# EAGLE design Pi-Bus_Breakout_IO (EAGLE 9.6.2)
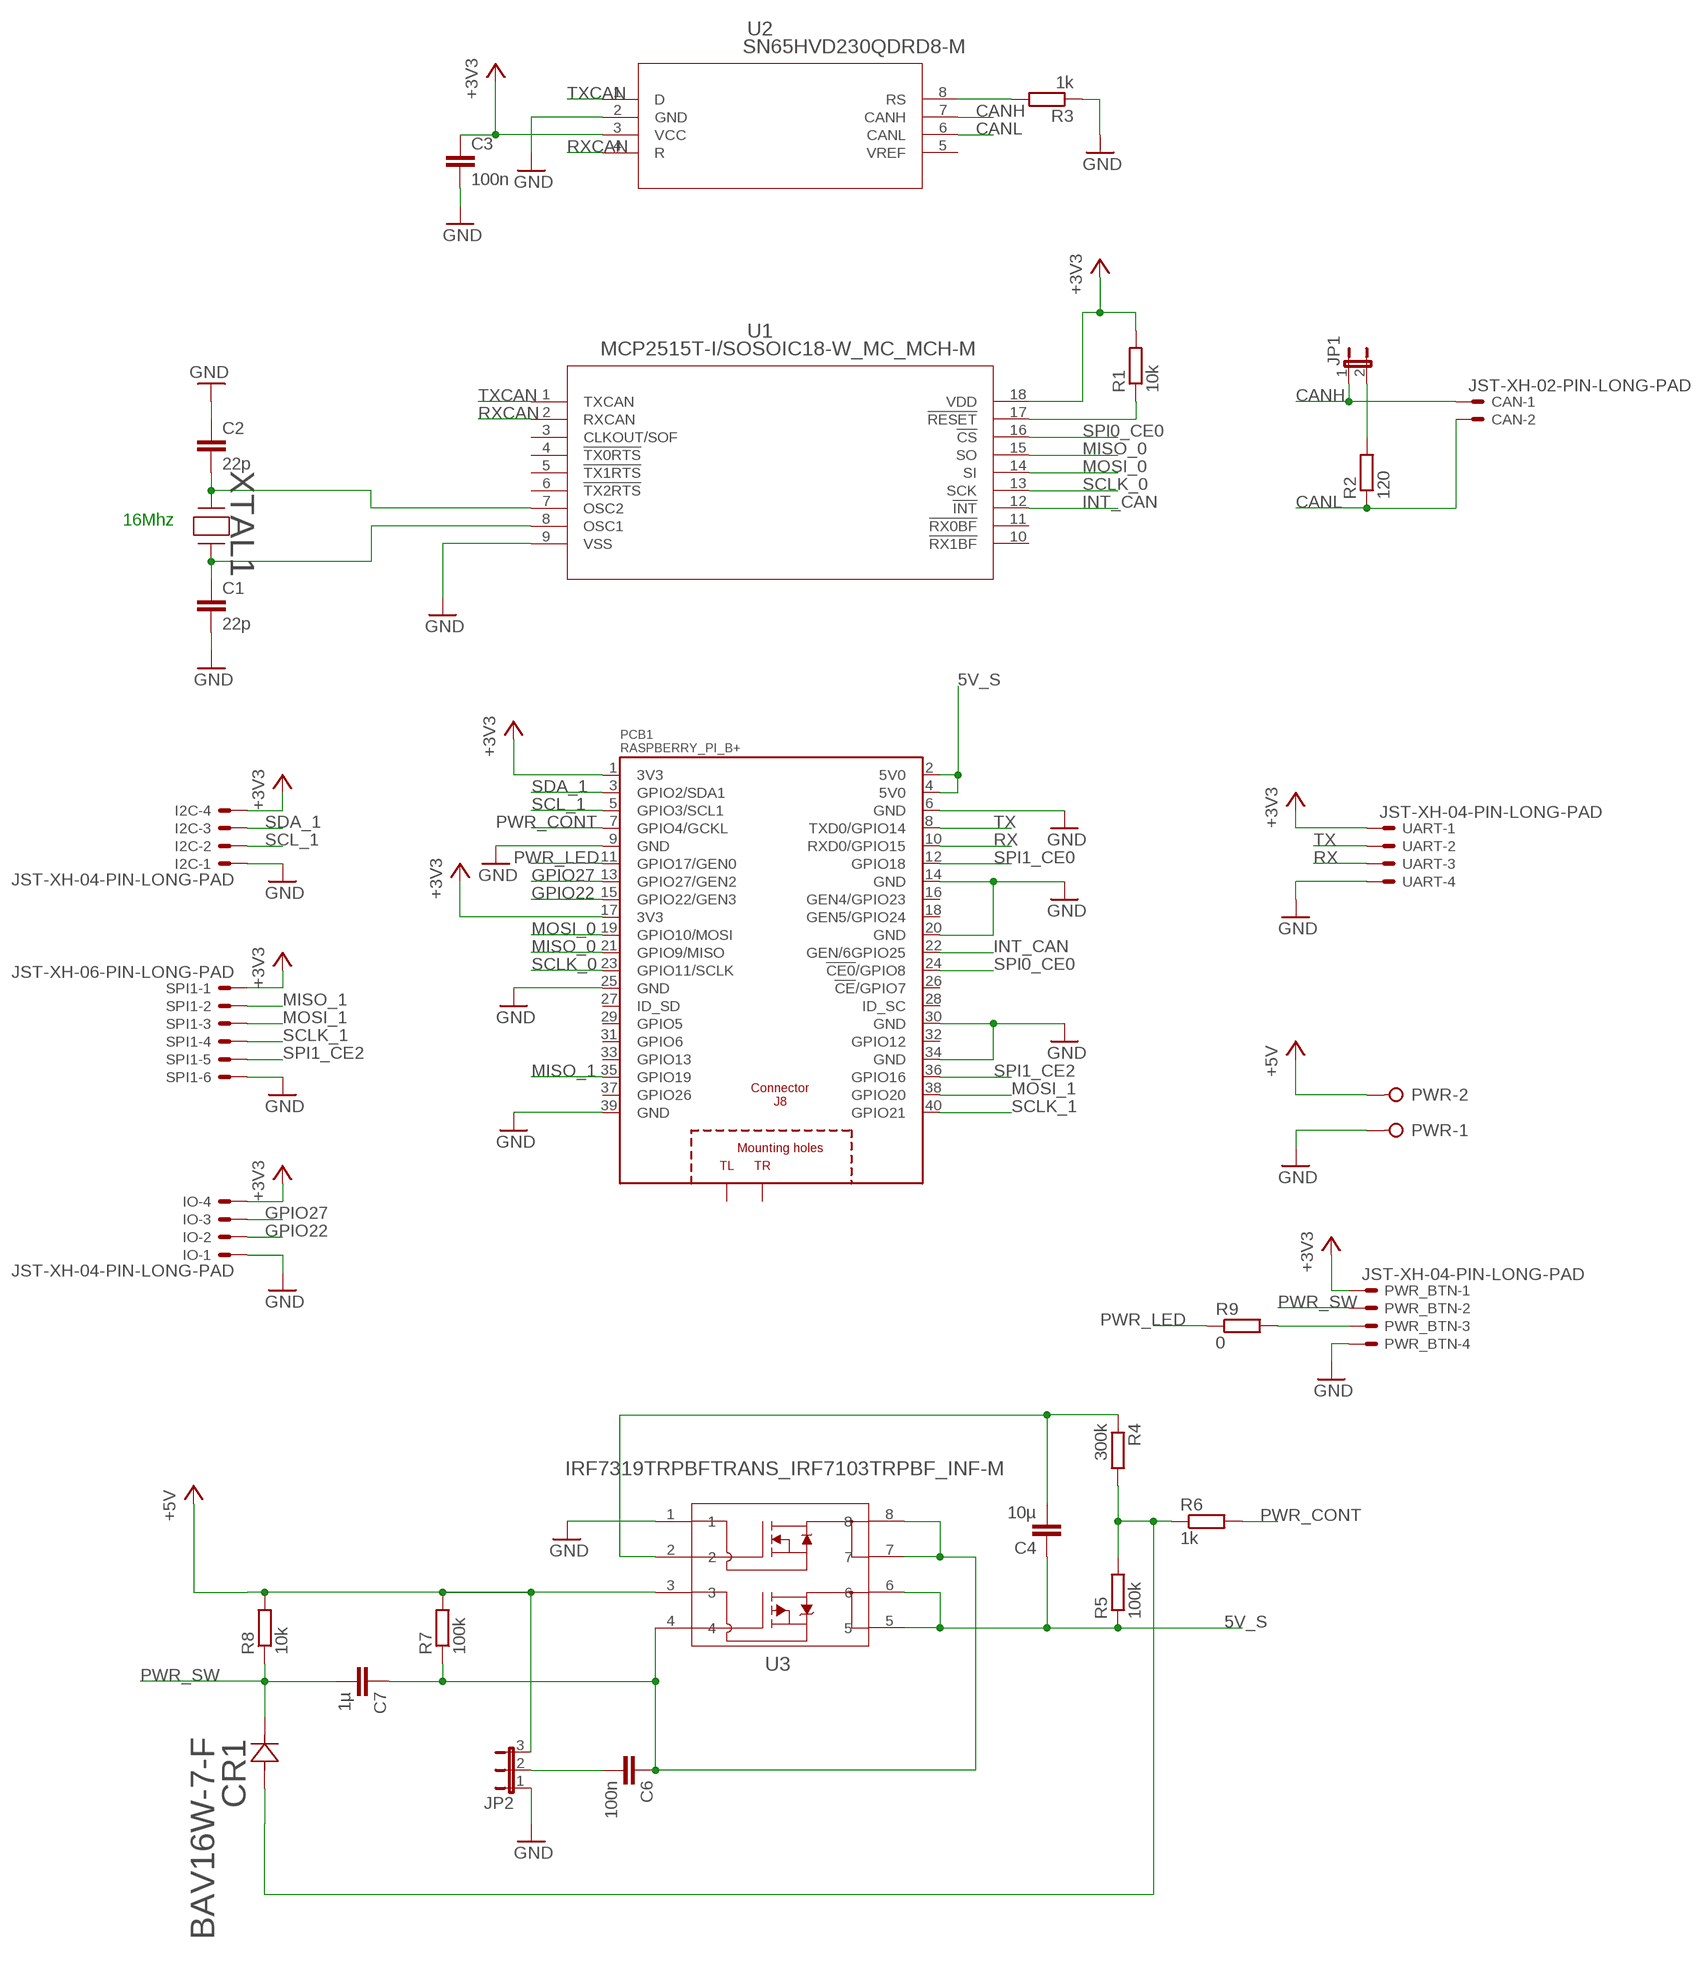
[diagram p0: schematic, sheet 1]

## Parts
C1  22p  C-EUC0805  [C0805]
C2  22p  C-EUC0805  [C0805]
C3  100n  C-EUC0805  [C0805]
C4  10µ  C-EUC0805  [C0805]
C6  100n  C-EUC0805  [C0805]
C7  1µ  C-EUC0805  [C0805]
CAN  JST-XH-02-PIN-LONG-PAD  [JST-XH-02-PACKAGE-LONG-PAD]
CR1  BAV16W-7-F  [SOD123_DIO]
I2C  JST-XH-04-PIN-LONG-PAD  [JST-XH-04-PACKAGE-LONG-PAD]
IO  JST-XH-04-PIN-LONG-PAD  [JST-XH-04-PACKAGE-LONG-PAD]
JP1  JP1E  [JP1]
JP2  JP2E  [JP2]
PCB1  RASPBERRY_PI_B+  [RASPBERRY_PI_B+]
PWR  W237-02P  [W237-132]
PWR_BTN  JST-XH-04-PIN-LONG-PAD  [JST-XH-04-PACKAGE-LONG-PAD]
R1  10k  R-EU_R0805  [R0805]
R2  120  R-EU_R0805  [R0805]
R3  1k  R-EU_R0805  [R0805]
R4  300k  R-EU_R0805  [R0805]
R5  100k  R-EU_R0805  [R0805]
R6  1k  R-EU_R0805  [R0805]
R7  100k  R-EU_R0805  [R0805]
R8  10k  R-EU_R0805  [R0805]
R9  0  R-EU_R0805  [R0805]
SPI1  JST-XH-06-PIN-LONG-PAD  [JST-XH-06-PACKAGE-LONG-PAD]
U1  MCP2515T-I/SOSOIC18-W_MC_MCH-M  [SOIC18-W_MC_MCH-M]
U2  SN65HVD230QDRD8-M  [D8-M]
U3  IRF7319TRPBFTRANS_IRF7103TRPBF_INF-M  [TRANS_IRF7103TRPBF_INF-M]
UART  JST-XH-04-PIN-LONG-PAD  [JST-XH-04-PACKAGE-LONG-PAD]
XTAL1  8Mhz  16.000MHZ_49USMX/30/50/40/18PF  [XTAL_8PF/ATF_EUR]

## Nets
5V_S: C4.1 PCB1.2(5V0) PCB1.4(5V0) R5.1 U3.5 U3.6
+3V3: C3.1 I2C.4 IO.4 PCB1.1(3V3) PCB1.17(3V3) PWR_BTN.1 R1.2 SPI1.1 U1.18(VDD) U2.3(VCC) UART.1
+5V: JP2.3 PWR.2 R7.2 R8.2 U3.3
CANH: CAN.1 JP1.1 U2.7(CANH)
CANL: CAN.2 R2.1 U2.6(CANL)
GND: C1.2 C2.1 C3.2 I2C.1 IO.1 JP2.1 PCB1.6(GND) PCB1.9(GND) PCB1.14(GND) PCB1.20(GND) PCB1.25(GND) PCB1.30(GND) PCB1.34(GND) PCB1.39(GND) PWR.1 PWR_BTN.4 R3.1 SPI1.6 U1.9(VSS) U2.2(GND) U3.1 UART.4
GPIO22: IO.2 PCB1.15(GPIO22/GEN3)
GPIO27: IO.3 PCB1.13(GPIO27/GEN2)
INT_CAN: PCB1.22(GEN/6GPIO25) U1.12(!INT)
MISO_0: PCB1.21(GPIO9/MISO) U1.15(SO)
MISO_1: PCB1.35(GPIO19) SPI1.2
MOSI_0: PCB1.19(GPIO10/MOSI) U1.14(SI)
MOSI_1: PCB1.38(GPIO20) SPI1.3
N$1: R1.1 U1.17(!RESET)
N$2: C1.1 U1.8(OSC1) XTAL1.2
N$3: C2.2 U1.7(OSC2) XTAL1.1
N$4: R3.2 U2.8(RS)
N$5: JP1.2 R2.2
N$6: CR1.2 R4.2 R5.2 R6.1
N$7: PWR_BTN.3 R9.2
N$8: C4.2 R4.1 U3.2
N$9: C6.2 JP2.2
N$12: C6.1 C7.1 R7.1 U3.4 U3.7 U3.8
PWR_CONT: PCB1.7(GPIO4/GCKL) R6.2
PWR_LED: PCB1.11(GPIO17/GEN0) R9.1
PWR_SW: C7.2 CR1.1 PWR_BTN.2 R8.1
RX: PCB1.10(RXD0/GPIO15) UART.3
RXCAN: U1.2(RXCAN) U2.4(R)
SCL_1: I2C.2 PCB1.5(GPIO3/SCL1)
SCLK_0: PCB1.23(GPIO11/SCLK) U1.13(SCK)
SCLK_1: PCB1.40(GPIO21) SPI1.4
SDA_1: I2C.3 PCB1.3(GPIO2/SDA1)
SPI0_CE0: PCB1.24(!CE0!/GPIO8) U1.16(!CS)
SPI1_CE0: PCB1.12(GPIO18)
SPI1_CE2: PCB1.36(GPIO16) SPI1.5
TX: PCB1.8(TXD0/GPIO14) UART.2
TXCAN: U1.1(TXCAN) U2.1(D)
Unconnected: PCB1.16(GEN4/GPIO23) PCB1.18(GEN5/GPIO24) PCB1.26(!CE!/GPIO7) PCB1.27(ID_SD) PCB1.28(ID_SC) PCB1.29(GPIO5) PCB1.31(GPIO6) PCB1.32(GPIO12) PCB1.33(GPIO13) PCB1.37(GPIO26) PCB1.PE_TL(TL) PCB1.PE_TR(TR) U1.3(CLKOUT/SOF) U1.4(!TX0RTS) U1.5(!TX1RTS) U1.6(!TX2RTS) U1.10(!RX1BF) U1.11(!RX0BF)

## Notes on the sheet
- 16Mhz

## Power pins joined to a net without a drawn wire
VREF: U2.5(VREF)

## Library data of the parts
C1-C4 C6 C7 = rcl:C-EU: CAPACITOR, European symbol; SPICEPREFIX: C
CAN = Rembrandt Electronics - JST XH Connectors v1-0:JST-XH-02-PIN: JST XH Connector 2 Pin Wire to board connector. Pitch: 2,54 mm, (0.100") Number of pins: 2 Created by Rembrandt Electronics www.rembrandtelectronics.com
CR1 = BAV16W-7-F:BAV16W-7-F; COPYRIGHT: Copyright (C) 2022 Ultra Librarian. All rights reserved.; MANUFACTURER_PART_NUMBER: BAV16W-7-F; MFR_NAME: Diodes Inc
I2C IO PWR_BTN UART = Rembrandt Electronics - JST XH Connectors v1-0:JST-XH-04-PIN: JST XH Connector 2 Pin Wire to board connector. Pitch: 2,54 mm, (0.100") Number of pins: 4 Created by Rembrandt Electronics www.rembrandtelectronics.com
JP1 = jumper:JP1E: JUMPER
JP2 = jumper:JP2E: JUMPER
PCB1 = my_RASPBERRY_PI_Bplus:RASPBERRY_PI_B+: Raspberry Pi B+ Based on issue: Thursday, July 10, 2014 - Rev 1.2 LBR by Tim R. 07-2014
PWR = con-wago-508:W237-02P: WAGO SREW CLAMP; OC_FARNELL: unknown; OC_NEWARK: unknown
R1-R9 = rcl:R-EU_: RESISTOR, European symbol; SPICEPREFIX: R
SPI1 = Rembrandt Electronics - JST XH Connectors v1-0:JST-XH-06-PIN: JST XH Connector 2 Pin Wire to board connector. Pitch: 2,54 mm, (0.100") Number of pins: 6 Created by Rembrandt Electronics www.rembrandtelectronics.com
U1 = MCP2515T-I_SO:MCP2515T-I/SO; COPYRIGHT: Copyright (C) 2022 Ultra Librarian. All rights reserved.; MANUFACTURER_PART_NUMBER: MCP2515T-I/SO; MFR_NAME: Microchip
U2 = SN65HVD230D:SN65HVD230QDR; COPYRIGHT: Copyright (C) 2022 Ultra Librarian. All rights reserved.; MANUFACTURER_PART_NUMBER: SN65HVD230QDR; MFR_NAME: Texas Instruments
U3 = IRF7319TRPBF:IRF7319TRPBF; COPYRIGHT: Copyright (C) 2022 Ultra Librarian. All rights reserved.; MANUFACTURER_PART_NUMBER: IRF7319TRPBF; MFR_NAME: Infineon
XTAL1 = 16Mhz 49USMX_30_50_40_18PF_ATF:16.000MHZ_49USMX/30/50/40/18PF; COPYRIGHT: Copyright (C) 2022 Ultra Librarian. All rights reserved.; MANUFACTURER_PART_NUMBER: 16.000MHZ 49USMX/30/50/40/18PF/ATF; MFR_NAME: Euroquartz

## Board
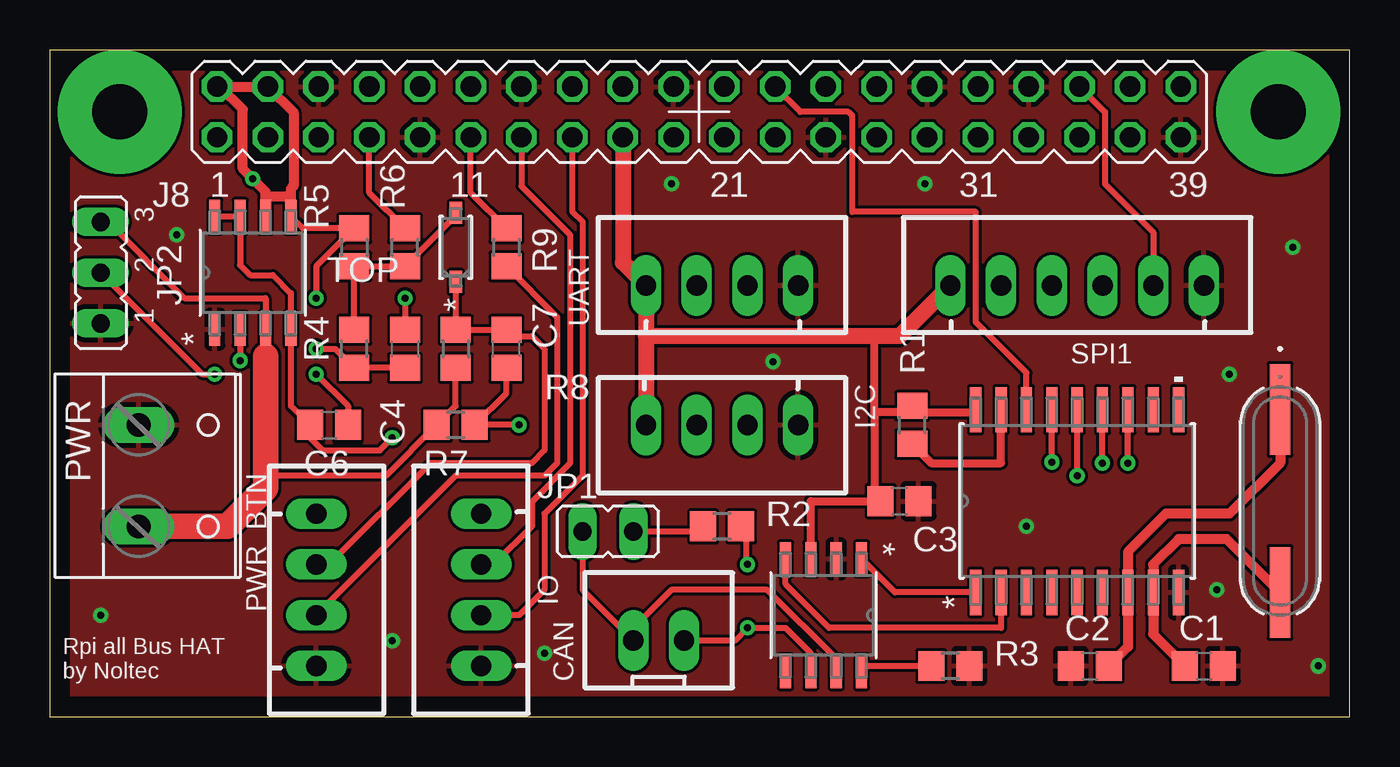
[diagram p1: board, top side]
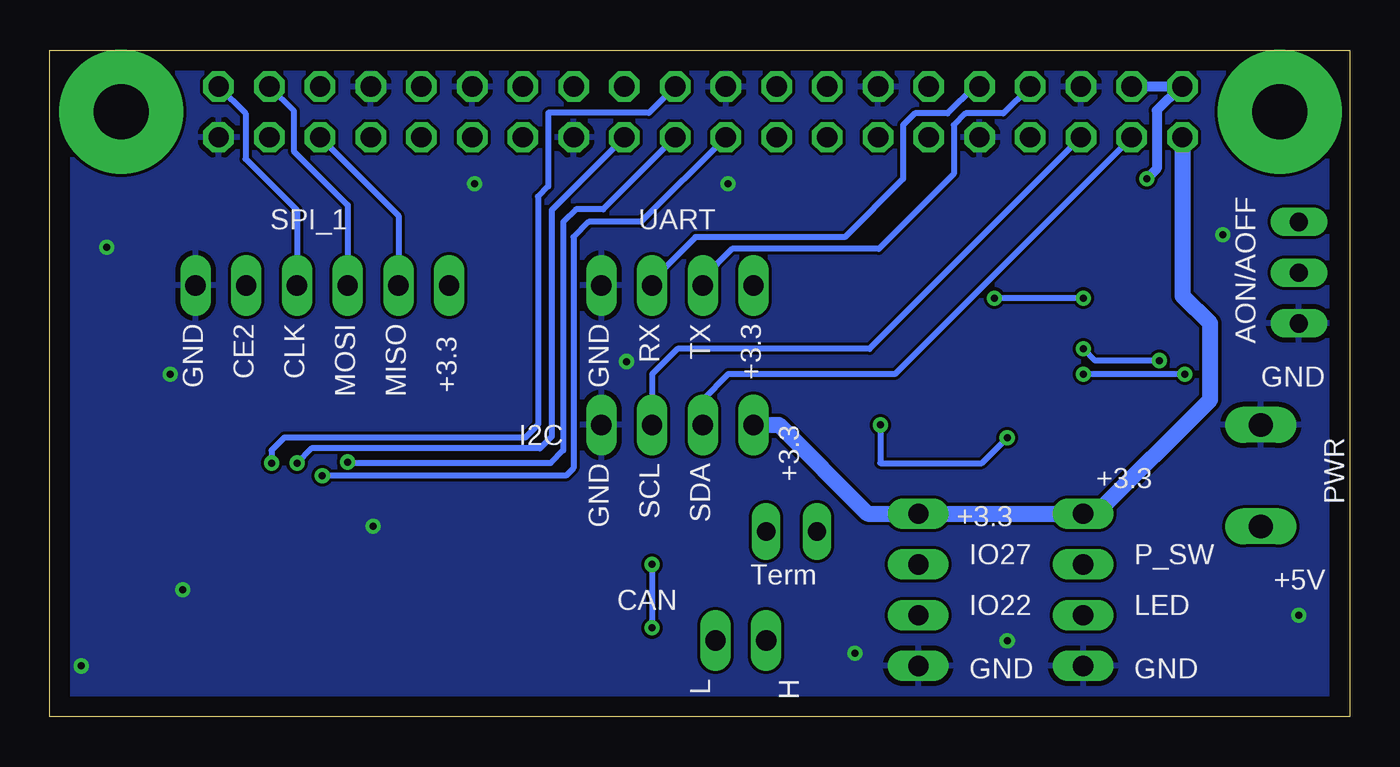
[diagram p2: board, bottom side, seen from below]

Size 65.08 x 33.37 mm. Coordinates in mm from the lower left corner, seen from the top.
Outline: 0,0 65.08,0 65.08,33.37 0,33.37 0,0
Copper layers (1*16): Top 0.035mm / dielectric 0.15mm / Bottom 0.035mm
Design rules "default *": minimum track width 6mil, minimum drill 0.35mm, track to track 6mil, track to pad 6mil, pad to pad 6mil, via to via 6mil, smd to smd 6mil, copper to edge 40mil, drill to drill 6mil, minimum pad ring 10mil, minimum via ring 8mil, stop-mask expansion 4mil, vias tented up to drill 14mil, thermal gap 10mil

### Footprints (pad centres in the part's own frame; a part is rotated, then mirrored left to right if it is on the bottom)
C0805 = smd 1.3 x 1.5: 1 -0.95,0; 2 0.95,0
JST-XH-02-PACKAGE-LONG-PAD = drill 1.016 long: 1 -1.27,0; 2 1.27,0
SOD123_DIO = smd 1.1 x 0.61: 1 -1.725,0; 2 1.725,0
JST-XH-04-PACKAGE-LONG-PAD = drill 1.016 long: 1 -3.81,0; 2 -1.27,0; 3 1.27,0; 4 3.81,0
JP1 = drill 0.914 long: 1 0,-1.27; 2 0,1.27
JP2 = drill 0.914 long: 1 -2.54,0; 2 0,0; 3 2.54,0
RASPBERRY_PI_B+ = drill 1.016 octagon: 1 12.18,-0.84; 2 12.18,1.7; 3 14.72,-0.84; 4 14.72,1.7; 5 17.26,-0.84; 6 17.26,1.7; 7 19.8,-0.84; 8 19.8,1.7; 9 22.34,-0.84; 10 22.34,1.7; 11 24.88,-0.84; 12 24.88,1.7; 13 27.42,-0.84; 14 27.42,1.7; 15 29.96,-0.84; 16 29.96,1.7; 17 32.5,-0.84; 18 32.5,1.7; 19 35.04,-0.84; 20 35.04,1.7; 21 37.58,-0.84; 22 37.58,1.7; 23 40.12,-0.84; 24 40.12,1.7; 25 42.66,-0.84; 26 42.66,1.7; 27 45.2,-0.84; 28 45.2,1.7; 29 47.74,-0.84; 30 47.74,1.7; 31 50.28,-0.84; 32 50.28,1.7; 33 52.82,-0.84; 34 52.82,1.7; 35 55.36,-0.84; 36 55.36,1.7; 37 57.9,-0.84; 38 57.9,1.7; 39 60.44,-0.84; 40 60.44,1.7 | drill 2.75 pad 6.2: PE_TL 7.31,0.43; PE_TR 65.31,0.43
W237-132 = drill 1.194 long: 1 -2.54,-0.635; 2 2.54,-0.635
R0805 = smd 1.3 x 1.5: 1 -0.95,0; 2 0.95,0
JST-XH-06-PACKAGE-LONG-PAD = drill 1.016 long: 1 -6.35,0; 2 -3.81,0; 3 -1.27,0; 4 1.27,0; 5 3.81,0; 6 6.35,0
SOIC18-W_MC_MCH-M = smd 2.27 x 0.558: 1 -4.571,5.08; 2 -4.571,3.81; 3 -4.571,2.54; 4 -4.571,1.27; 5 -4.571,0; 6 -4.571,-1.27; 7 -4.571,-2.54; 8 -4.571,-3.81; 9 -4.571,-5.08; 10 4.571,-5.08; 11 4.571,-3.81; 12 4.571,-2.54; 13 4.571,-1.27; 14 4.571,0; 15 4.571,1.27; 16 4.571,2.54; 17 4.571,3.81; 18 4.571,5.08
D8-M = smd 1.655 x 0.558: 1 -2.821,1.905; 2 -2.821,0.635; 3 -2.821,-0.635; 4 -2.821,-1.905; 5 2.821,-1.905; 6 2.821,-0.635; 7 2.821,0.635; 8 2.821,1.905
TRANS_IRF7103TRPBF_INF-M = smd 1.655 x 0.558: 1 -2.821,1.905; 2 -2.821,0.635; 3 -2.821,-0.635; 4 -2.821,-1.905; 5 2.821,-1.905; 6 2.821,-0.635; 7 2.821,0.635; 8 2.821,1.905
XTAL_8PF/ATF_EUR = smd 4.54 x 1.035: 1 -4.58,0; 2 4.58,0

### Placement (x,y rotation side)
C1  57.78,2.54 0 top
C2  52.07,2.54 0 top
C3  42.54,10.79 0 top
C4  17.78,18.41 270 top
C6  13.97,14.61 0 top
C7  22.86,18.41 90 top
CAN  30.48,3.81 0 top
CR1  20.32,23.5 90 top
I2C  33.65,14.61 180 top
IO  21.59,6.35 90 top
JP1  27.94,9.27 270 top
JP2  2.54,22.23 90 top
PCB1  -3.81,29.84 0 top
PWR  5.08,12.06 270 top
PWR_BTN  13.34,6.35 270 top
R1  43.18,14.61 90 top
R2  33.65,9.53 180 top
R3  45.08,2.54 180 top
R4  15.24,18.41 90 top
R5  15.24,23.5 270 top
R6  17.78,23.5 90 top
R7  20.32,14.61 180 top
R8  20.32,18.41 270 top
R9  22.86,23.5 270 top
SPI1  51.43,21.59 0 top
U1  51.43,10.79 90 top
U2  38.73,5.08 270 top
U3  10.16,22.23 90 top
UART  33.65,21.59 0 top
XTAL1  61.59,10.79 270 top

### Tracks (layer width: path | path; a pad name or v marks a point on that pad's centre or on a via)
5V_S  (via drill 0.35)
  Top 0.305: U3.5 12.67,24.45 R5.1 13.34,22.54 v13.34,20.95 | v17.78,20.95 C4.1
  Top 0.508: PCB1.2 8.51,31.55 | 8.51,31.55 PCB1.4 12.19,30.26 12.19,26.54 12.07,26.42 12.07,26.04 | 12.07,26.04 U3.5 | U3.6 10.79,26.04 | 10.79,26.04 10.79,26.29 v10.16,26.92 9.65,27.43 9.65,30.4 8.51,31.55 | 12.07,26.04 10.79,26.04
  Bottom 0.305: v13.34,20.95 v17.78,20.95
  Bottom 0.508: PCB1.4 PCB1.2 8.46,31.55 9.65,30.35 9.65,27.43 v10.16,26.92
+3V3
  Top 0.406: U1.18 46.35,15.24 43.49,15.24 R1.2 42.86,15.24 41.27,15.24 | U2.3 38.1,10.79 C3.1 41.27,11.12 41.27,15.24 | 41.27,15.24 41.27,19.05
  Top 0.813: 29.84,19.05 UART.1 28.69,22.75 PCB1.17 | 29.84,19.05 I2C.4 | SPI1.1 42.54,19.05 41.27,19.05 29.84,19.05
  Bottom 0.813: I2C.4 28.57,14.61 24.13,10.16 IO.4 PWR_BTN.1 12.7,10.16 6.99,15.88 6.99,19.68 8.37,21.07 PCB1.1
+5V
  Top 0.305: R8.2 20.32,15.55 R7.2 16.83,12.06 10.79,12.06 | JP2.3 2.92,24.77 6.73,20.95 10.79,20.95 U3.3
  Top 0.508: U3.3 10.79,18.03
  Top 1.27: PWR.2 8.89,9.53 10.79,11.43 10.79,12.06 10.79,18.03
CANH
  Top 0.305: U2.7 39.37,2.89 35.91,6.35 31.11,6.35 29.21,4.45 CAN.1 26.67,6.35 JP1.1
CANL  (via drill 0.35)
  Top 0.305: CAN.2 34.29,3.81 v34.92,4.45 36.83,4.45 38.1,3.17 U2.6 | R2.1 34.86,9.27 34.86,7.69 v34.92,7.62
  Bottom 0.305: v34.92,7.62 v34.92,4.45
GND  (via drill 0.35)
  other vias: 17.14,3.81 48.89,9.53 6.35,24.13 63.5,2.54 2.54,5.08 43.81,26.67 24.77,3.17 62.23,23.5 36.2,17.78 58.42,6.35 59.05,17.14 31.11,26.67
  pour Top: 0,34.29 0,0 65.41,0 65.41,34.29
  pour Bottom: 0,34.29 0,0.64 65.41,0.64 65.41,34.29
GPIO22
  Top 0.305: PCB1.15 26.15,25.29 26.67,24.77 26.67,12.06 24.77,10.16 24.77,6.35 23.5,5.08 IO.2
GPIO27
  Top 0.305: PCB1.13 23.61,26.55 26.04,24.13 26.04,12.68 24.13,10.77 24.13,9.53 22.23,7.62 IO.3
INT_CAN  (via drill 0.35)
  Top 0.305: v53.97,12.7 U1.12
  Bottom 0.305: PCB1.22 35.09,30.23 40.13,30.23 40.13,26.54 40.64,26.04 40.64,14.61 41.27,13.97 53.34,13.97 53.97,13.34 v53.97,12.7
MISO_0  (via drill 0.35)
  Top 0.305: v50.16,12.75 U1.15
  Bottom 0.305: PCB1.21 37.38,25.4 38.73,25.4 39.37,24.77 39.37,13.34 40,12.7 50.16,12.7 v50.16,12.75
MISO_1
  Bottom 0.305: PCB1.35 47.62,25.08 SPI1.2
MOSI_0  (via drill 0.35)
  Top 0.305: v51.43,12.06 U1.14
  Bottom 0.305: PCB1.19 35.47,24.77 38.1,24.77 38.86,24 38.86,12.45 39.24,12.06 v51.43,12.06
MOSI_1
  Bottom 0.305: PCB1.38 52.87,30.33 52.87,28.31 50.16,25.6 SPI1.3
N$1
  Top 0.406: R1.1 44.13,12.7 47.62,12.7 U1.17
N$2
  Top 0.508: XTAL1.2 58.92,8.89 56.51,8.89 55.24,7.62 U1.8 55.24,4.13 C1.1
N$3
  Top 0.508: XTAL1.1 61.59,12.7 59.05,10.16 55.88,10.16 53.97,8.26 U1.7 53.97,3.5 C2.2
N$4
  Top 0.305: U2.8 40.92,2.54 R3.2
N$5
  Top 0.305: R2.2 32.45,9.27 JP1.2
N$6
  Top 0.305: R4.2 R5.2 R6.1 20.32,25.09 CR1.2
N$7
  Top 0.305: R9.2 25.4,20 25.4,12.69 24.78,12.06 20.32,12.06 PWR_BTN.3
N$8  (via drill 0.35)
  Top 0.305: C4.2 R4.1 14.29,18.41 v13.34,18.41 | U3.2 v9.53,17.83
  Bottom 0.305: v9.53,17.83 12.75,17.83 v13.34,18.41
N$9  (via drill 0.35)
  Top 0.305: JP2.2 7.62,17.14 v8.26,17.14 | v13.34,17.14 14.92,15.56 C6.2
  Bottom 0.305: v8.26,17.14 v13.34,17.14
N$12  (via drill 0.35)
  Top 0.305: U3.8 U3.7 9.53,22.61 10.03,22.1 11.18,22.1 12.07,21.21 U3.4 12.07,15.56 C6.1 13.02,13.97 13.66,13.34 16.51,13.34 v17.14,13.97 | C7.1 22.86,16.2 R7.1 v23.5,14.61
  Bottom 0.305: v17.14,13.97 18.41,12.7 23.5,12.7 v23.5,14.61
PWR_CONT
  Top 0.305: R6.2 15.99,26.23 PCB1.7
PWR_LED
  Top 0.305: R9.1 21.07,26.23 PCB1.11
PWR_SW
  Top 0.305: CR1.1 R8.1 C7.2 23.18,19.05 24.13,19.05 24.77,18.41 24.77,13.34 24.13,12.7 19.05,12.7 13.97,7.62 PWR_BTN.2
RX
  Bottom 0.305: PCB1.10 18.78,31.55 20.13,30.2 21.77,30.2 22.35,29.61 22.35,26.92 25.27,24 32.75,24 34.92,21.83 UART.3
RXCAN
  Top 0.305: U1.2 47.62,4.45 39.02,4.45 36.83,6.63 U2.4
SCL_1
  Bottom 0.305: PCB1.5 24.04,18.41 33.65,18.41 34.92,17.14 I2C.2
SCLK_0  (via drill 0.35)
  Top 0.305: v52.7,12.7 U1.13
  Bottom 0.305: PCB1.23 39.95,25.36 39.95,14.02 40.54,13.43 51.97,13.43 v52.7,12.7
SCLK_1
  Bottom 0.305: PCB1.40 55.28,30.2 55.28,27.93 52.7,25.35 SPI1.4
SDA_1
  Bottom 0.305: PCB1.3 22.77,17.14 31.11,17.14 32.38,15.88 I2C.3
SPI0_CE0
  Top 0.305: U1.16 48.89,17.21 46.35,19.75 46.35,25.27 40.17,25.27 40.17,30.08 39.98,30.27 37.58,30.27 PCB1.24
SPI1_CE2
  Top 0.305: PCB1.36 52.83,30.26 52.83,26.67 55.24,24.26 SPI1.5
TX
  Bottom 0.305: PCB1.8 17.34,30.2 19.23,30.2 19.81,29.61 19.81,27.18 23.57,23.42 30.92,23.42 32.38,21.96 UART.2
TXCAN
  Top 0.305: U1.1 42.32,6.22 U2.1

### Text on the board
tNames: Rpi all Bus HAT / by Noltec
bNames: AON/AOFF | UART | SPI_1 | +3.3 | TX | RX | GND | MISO | MOSI | CLK | CE2 | GND | +3.3 | GND | +3.3 | I2C | PWR | SDA | SCL | GND | +3.3 | +3.3 | P_SW | IO27 | Term | +5V | CAN | LED | IO22 | GND | GND | H | L